# EAGLE schematic Motor_Brushed_20x7mm (EAGLE 6.5.0)
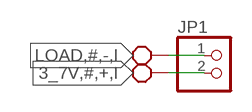
[diagram p0: schematic, sheet 1]

## Parts
JP1  PINHD-1X2  [1X02]

## Nets
3_7V,#,+,I: JP1.2 ; supply symbol labelled BLOCK_REQUIREMENT
LOAD,#,-,I: JP1.1 ; supply symbol labelled BLOCK_REQUIREMENT

## Library data of the parts
JP1 = pinhead:PINHD-1X2: PIN HEADER